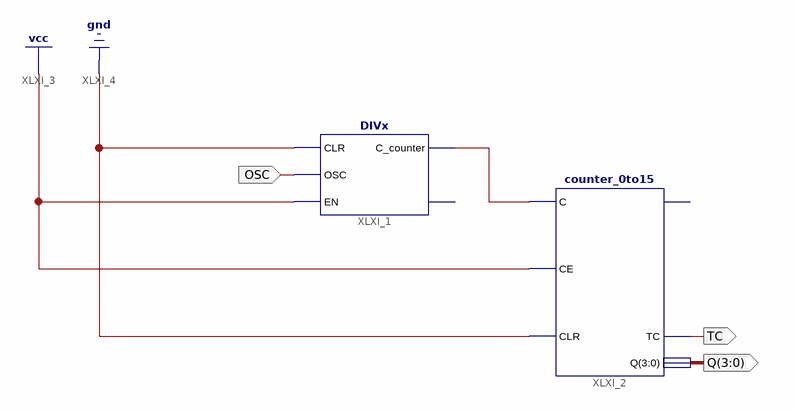
[diagram p0: schematic sheet 1]
// Xilinx ISE schematic test.sch (spartan6) as structural Verilog: 2 symbols, 3 ports
module test (
  input  OSC,
  output [3:0] Q,
  output TC
);

  wire XLXN_5;

  DIVx XLXI_1 (.CLR(1'b0), .OSC(OSC), .EN(1'b1), .C_counter(XLXN_5));  // open: C_Display
  counter_0to15 XLXI_2 (.C(XLXN_5), .CE(1'b1), .CLR(1'b0), .TC(TC), .Q(Q));  // open: CEO
endmodule
